# Altium schematic sheet FAT93.SchDoc
size B
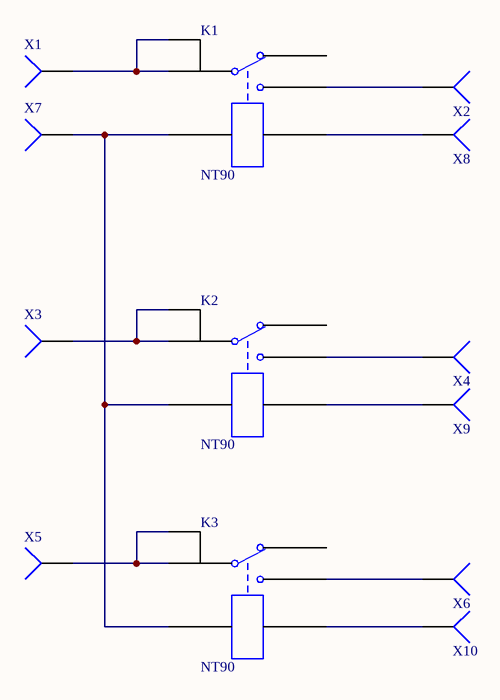
[diagram p0: FAT93.SchDoc]

## Parts
K1  NT90  [NT90]
K2  NT90  [NT90]
K3  NT90  [NT90]
X1  Socket  [k13-4-9]  (value not drawn)
X2  Socket  [k13-4-9]  (value not drawn)
X3  Socket  [k13-4-9]  (value not drawn)
X4  Socket  [k13-4-9]  (value not drawn)
X5  Socket  [k13-4-9]  (value not drawn)
X6  Socket  [k13-4-9]  (value not drawn)
X7  Socket  [DJ614-2.8]  (value not drawn)
X8  Socket  [DJ614-2.8]  (value not drawn)
X9  Socket  [DJ614-2.8]  (value not drawn)
X10  Socket  [DJ614-2.8]  (value not drawn)

## Nets
NetK1_1: K1.1 K1.6 X1.1
NetK1_3: K1.3 X2.1
NetK1_4: K1.4 K2.4 K3.4 X7.1
NetK1_5: K1.5 X8.1
NetK2_1: K2.1 K2.6 X3.1
NetK2_3: K2.3 X4.1
NetK2_5: K2.5 X9.1
NetK3_1: K3.1 K3.6 X5.1
NetK3_3: K3.3 X6.1
NetK3_5: K3.5 X10.1

Not connected (* = marked no-connect by the designer): K1 2; K2 2; K3 2

## Library data of the parts
K1-K3 = NT90: Single-Pole Dual-Throw Relay; Manufacturer: Generic Components; Class I: Electro-mechanical; Published: 24-Mar-1999; Revision: July-2002: Re-released for DXP Platform.; Publisher: Altium Limited; Class II: Relay
X1-X10 = Socket: Manufacturer: Generic Components; Class I: Connector; Revision: July-2002: Re-released for DXP Platform.; Publisher: Altium Limited